# Altium schematic sheet 5 SiPM.SchDoc
size A
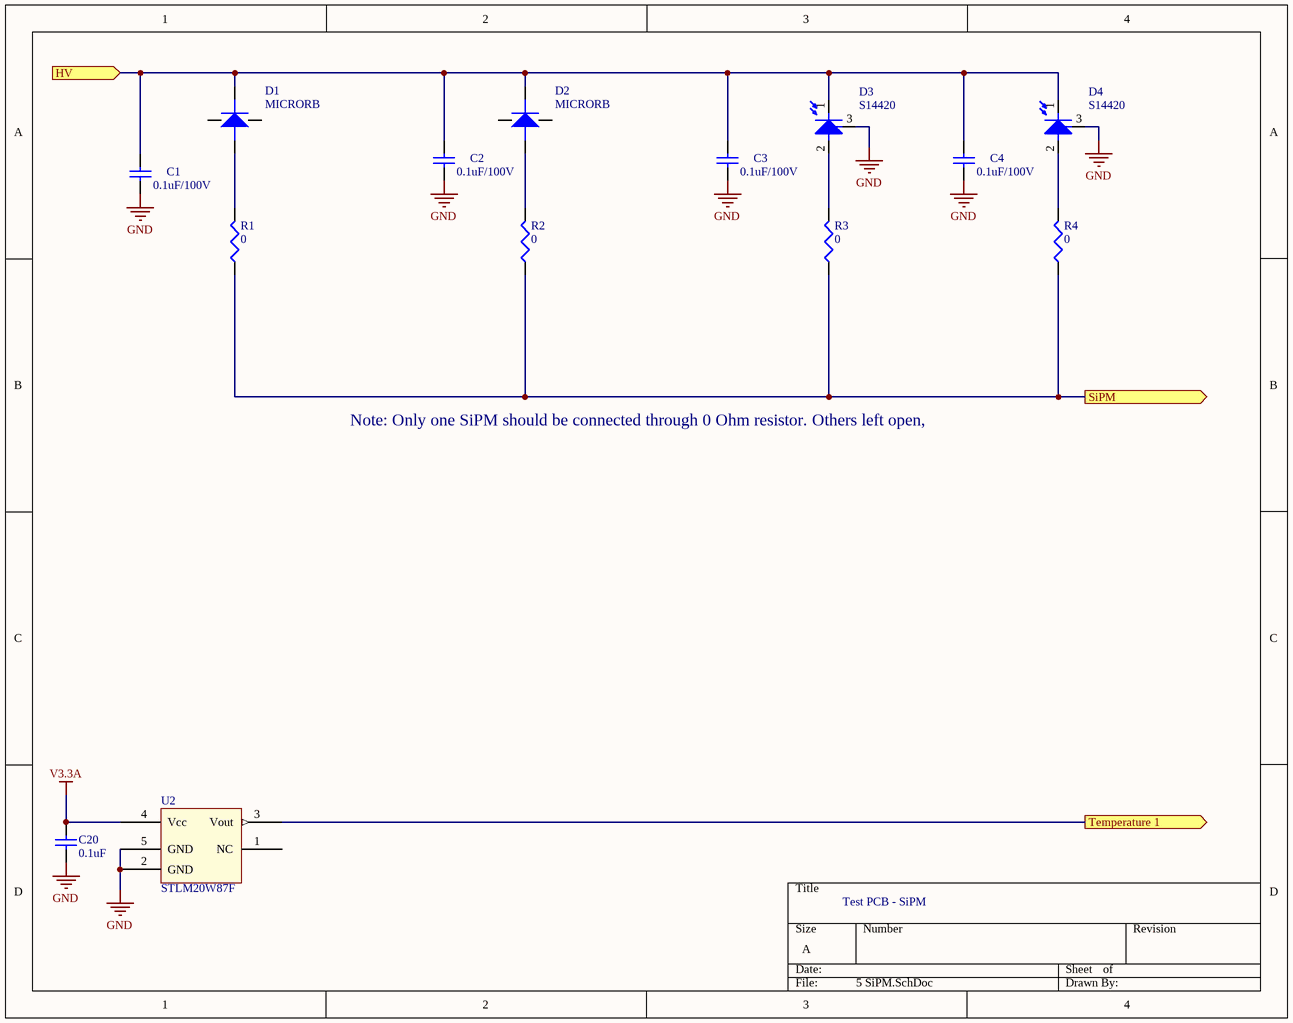
[diagram p0: 5 SiPM.SchDoc]

## Parts
C1  0.1uF/100V  [C0603]
C2  0.1uF/100V  [C0603]
C3  0.1uF/100V  [C0603]
C4  0.1uF/100V  [C0603]
C20  0.1uF  [C0402]
D1  MICRORB  [MICRORB]
D2  MICRORB  [MICRORB]
D3  S14420  [Photodiode 3pin 200mil]
D4  S14420  [Photodiode 3pin 200mil]
R1  0  [R0603]
R2  0  [R0603]
R3  0  [R0603]
R4  0  [R0603]
U2  STLM20W87F  [SOT323-5]

## Ports
HV (in), SiPM (out), Temperature 1 (out)

## Nets
GND: C1.1 C2.1 C3.1 C4.1 C20.1 D3.3(GND) D4.3(GND) U2.2(GND) U2.5(GND)
V3.3A: C20.2 U2.4(Vcc)
HV: C1.2 C2.2 C3.2 C4.2 D1.3(Cathode) D2.3(Cathode) D3.1(K) D4.1(K) ; port HV
SiPM: R1.1 R2.1 R3.1 R4.1 ; port SiPM
Temperature 1: U2.3(Vout) ; port Temperature 1
NetD1_1: D1.1(Anode) R1.2
NetD2_1: D2.1(Anode) R2.2
NetD3_2: D3.2(A) R3.2
NetD4_2: D4.2(A) R4.2

Not connected (* = marked no-connect by the designer): D1 2(Fast_output) 4(NC); D2 2(Fast_output) 4(NC); U2 1(NC)

## Notes on the sheet
- Note: Only one SiPM should be connected through 0 Ohm resistor. Others left open,
- Test PCB - SiPM

## Library data of the parts
C1-C4 C20 = Cap SM: Capacitor, SM; Published: 8-Jun-2000; LatestRevisionDate: 29-May-2009; LatestRevisionNote: IPC-7351 Footprint Added.; PackageReference: C1206; Publisher: Altium Limited; PackageDescription: Chip Capacitor
  C1-C4: Value: 0.1uF/100V
  C20: Value: 0.1uF
D1 D2 = MICRORB: SiPM
R1-R4 = Res SM: Resistor; Published: 8-Jun-2000; LatestRevisionDate: 29-May-2009; LatestRevisionNote: IPC-7351 Footprint Added.; PackageReference: J1-0603; Publisher: Altium Limited; PackageDescription: Chip Resistor; Value: 0
U2 = STML20W87F